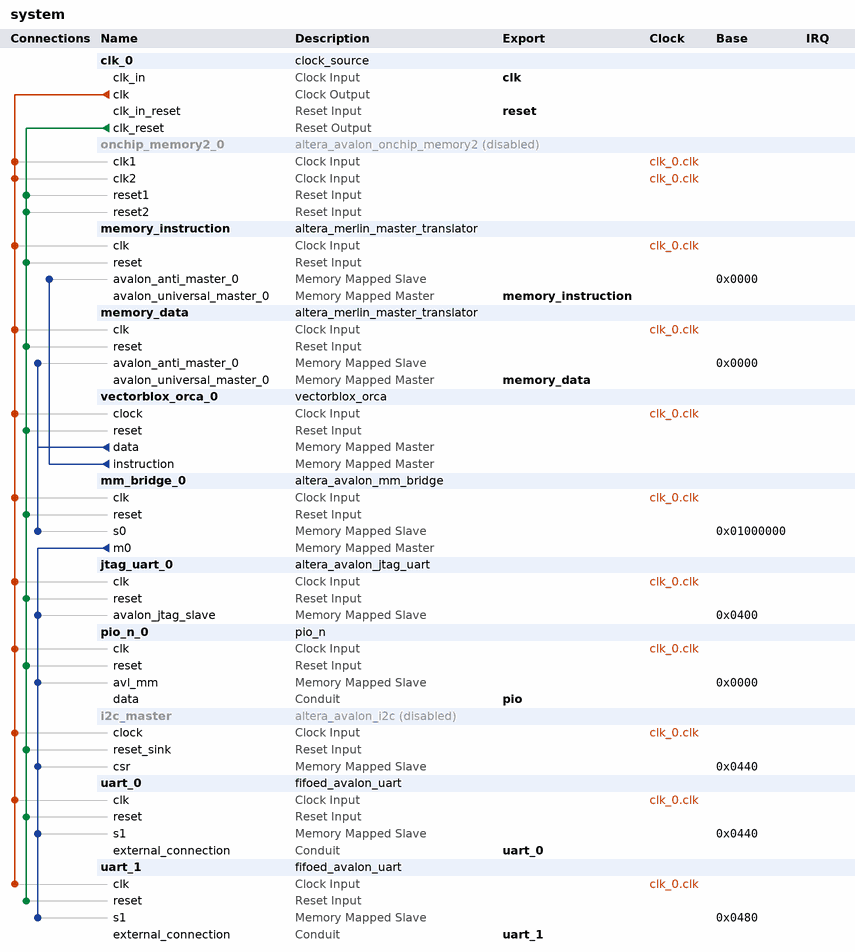
[diagram p0: system contents]
# Platform Designer (Qsys) system system, Cyclone V 5CSEBA6U23I7
# Parameters at their usual value, and those the tool derives, are not listed.
package require -exact qsys 16.1
create_system system
set_project_property DEVICE_FAMILY {Cyclone V}
set_project_property DEVICE 5CSEBA6U23I7

add_instance clk_0 clock_source 16.1
set_instance_parameter_value clk_0 clockFrequency 50000000

add_instance onchip_memory2_0 altera_avalon_onchip_memory2 16.1
set_instance_property onchip_memory2_0 ENABLED false
set_instance_parameter_value onchip_memory2_0 dataWidth 32
set_instance_parameter_value onchip_memory2_0 dualPort true
set_instance_parameter_value onchip_memory2_0 initMemContent true
set_instance_parameter_value onchip_memory2_0 initializationFileName system.hex
set_instance_parameter_value onchip_memory2_0 memorySize 65536
set_instance_parameter_value onchip_memory2_0 useNonDefaultInitFile true

add_instance memory_instruction altera_merlin_master_translator 16.1
set_instance_parameter_value memory_instruction AV_ADDRESSGROUP 0
set_instance_parameter_value memory_instruction AV_ADDRESS_SYMBOLS 0
set_instance_parameter_value memory_instruction AV_ADDRESS_W 22
set_instance_parameter_value memory_instruction AV_ALWAYSBURSTMAXBURST 0
set_instance_parameter_value memory_instruction AV_BITS_PER_SYMBOL 8
set_instance_parameter_value memory_instruction AV_BURSTBOUNDARIES 0
set_instance_parameter_value memory_instruction AV_BURSTCOUNT_SYMBOLS 0
set_instance_parameter_value memory_instruction AV_BURSTCOUNT_W 1
set_instance_parameter_value memory_instruction AV_BYTEENABLE_W 4
set_instance_parameter_value memory_instruction AV_CONSTANT_BURST_BEHAVIOR 0
set_instance_parameter_value memory_instruction AV_DATA_HOLD 0
set_instance_parameter_value memory_instruction AV_DATA_W 32
set_instance_parameter_value memory_instruction AV_INTERLEAVEBURSTS 0
set_instance_parameter_value memory_instruction AV_ISBIGENDIAN 0
set_instance_parameter_value memory_instruction AV_LINEWRAPBURSTS 0
set_instance_parameter_value memory_instruction AV_MAX_PENDING_READ_TRANSACTIONS 64
set_instance_parameter_value memory_instruction AV_READLATENCY 0
set_instance_parameter_value memory_instruction AV_READ_WAIT 0
set_instance_parameter_value memory_instruction AV_REGISTERINCOMINGSIGNALS 0
set_instance_parameter_value memory_instruction AV_REGISTEROUTGOINGSIGNALS 0
set_instance_parameter_value memory_instruction AV_SETUP_WAIT 0
set_instance_parameter_value memory_instruction AV_SYMBOLS_PER_WORD 4
set_instance_parameter_value memory_instruction AV_WRITE_WAIT 0
set_instance_parameter_value memory_instruction SYNC_RESET 0
set_instance_parameter_value memory_instruction UAV_ADDRESSGROUP 0
set_instance_parameter_value memory_instruction UAV_ADDRESS_W 24
set_instance_parameter_value memory_instruction UAV_BURSTCOUNT_W 1
set_instance_parameter_value memory_instruction UAV_CONSTANT_BURST_BEHAVIOR 0
set_instance_parameter_value memory_instruction USE_ADDRESS 1
set_instance_parameter_value memory_instruction USE_BEGINBURSTTRANSFER 0
set_instance_parameter_value memory_instruction USE_BEGINTRANSFER 0
set_instance_parameter_value memory_instruction USE_BURSTCOUNT 0
set_instance_parameter_value memory_instruction USE_BYTEENABLE 1
set_instance_parameter_value memory_instruction USE_CHIPSELECT 1
set_instance_parameter_value memory_instruction USE_CLKEN 1
set_instance_parameter_value memory_instruction USE_DEBUGACCESS 0
set_instance_parameter_value memory_instruction USE_LOCK 0
set_instance_parameter_value memory_instruction USE_READ 1
set_instance_parameter_value memory_instruction USE_READDATA 1
set_instance_parameter_value memory_instruction USE_READDATAVALID 1
set_instance_parameter_value memory_instruction USE_READRESPONSE 0
set_instance_parameter_value memory_instruction USE_WAITREQUEST 0
set_instance_parameter_value memory_instruction USE_WRITE 1
set_instance_parameter_value memory_instruction USE_WRITEDATA 1
set_instance_parameter_value memory_instruction USE_WRITERESPONSE 0

add_instance memory_data altera_merlin_master_translator 16.1
set_instance_parameter_value memory_data AV_ADDRESSGROUP 0
set_instance_parameter_value memory_data AV_ADDRESS_SYMBOLS 0
set_instance_parameter_value memory_data AV_ADDRESS_W 22
set_instance_parameter_value memory_data AV_ALWAYSBURSTMAXBURST 0
set_instance_parameter_value memory_data AV_BITS_PER_SYMBOL 8
set_instance_parameter_value memory_data AV_BURSTBOUNDARIES 0
set_instance_parameter_value memory_data AV_BURSTCOUNT_SYMBOLS 0
set_instance_parameter_value memory_data AV_BURSTCOUNT_W 1
set_instance_parameter_value memory_data AV_BYTEENABLE_W 4
set_instance_parameter_value memory_data AV_CONSTANT_BURST_BEHAVIOR 0
set_instance_parameter_value memory_data AV_DATA_HOLD 0
set_instance_parameter_value memory_data AV_DATA_W 32
set_instance_parameter_value memory_data AV_INTERLEAVEBURSTS 0
set_instance_parameter_value memory_data AV_ISBIGENDIAN 0
set_instance_parameter_value memory_data AV_LINEWRAPBURSTS 0
set_instance_parameter_value memory_data AV_MAX_PENDING_READ_TRANSACTIONS 64
set_instance_parameter_value memory_data AV_READLATENCY 0
set_instance_parameter_value memory_data AV_READ_WAIT 0
set_instance_parameter_value memory_data AV_REGISTERINCOMINGSIGNALS 0
set_instance_parameter_value memory_data AV_REGISTEROUTGOINGSIGNALS 0
set_instance_parameter_value memory_data AV_SETUP_WAIT 0
set_instance_parameter_value memory_data AV_SYMBOLS_PER_WORD 4
set_instance_parameter_value memory_data AV_WRITE_WAIT 0
set_instance_parameter_value memory_data SYNC_RESET 0
set_instance_parameter_value memory_data UAV_ADDRESSGROUP 0
set_instance_parameter_value memory_data UAV_ADDRESS_W 24
set_instance_parameter_value memory_data UAV_BURSTCOUNT_W 1
set_instance_parameter_value memory_data UAV_CONSTANT_BURST_BEHAVIOR 0
set_instance_parameter_value memory_data USE_ADDRESS 1
set_instance_parameter_value memory_data USE_BEGINBURSTTRANSFER 0
set_instance_parameter_value memory_data USE_BEGINTRANSFER 0
set_instance_parameter_value memory_data USE_BURSTCOUNT 0
set_instance_parameter_value memory_data USE_BYTEENABLE 1
set_instance_parameter_value memory_data USE_CHIPSELECT 1
set_instance_parameter_value memory_data USE_CLKEN 1
set_instance_parameter_value memory_data USE_DEBUGACCESS 0
set_instance_parameter_value memory_data USE_LOCK 0
set_instance_parameter_value memory_data USE_READ 1
set_instance_parameter_value memory_data USE_READDATA 1
set_instance_parameter_value memory_data USE_READDATAVALID 1
set_instance_parameter_value memory_data USE_READRESPONSE 0
set_instance_parameter_value memory_data USE_WAITREQUEST 0
set_instance_parameter_value memory_data USE_WRITE 1
set_instance_parameter_value memory_data USE_WRITEDATA 1
set_instance_parameter_value memory_data USE_WRITERESPONSE 0

add_instance vectorblox_orca_0 vectorblox_orca 1.0
set_instance_parameter_value vectorblox_orca_0 BRANCH_PREDICTION false
set_instance_parameter_value vectorblox_orca_0 BTB_SIZE 0
set_instance_parameter_value vectorblox_orca_0 BUS_TYPE Avalon
set_instance_parameter_value vectorblox_orca_0 COUNTER_LENGTH 64
set_instance_parameter_value vectorblox_orca_0 DIVIDE_ENABLE 1
set_instance_parameter_value vectorblox_orca_0 ENABLE_EXCEPTIONS 1
set_instance_parameter_value vectorblox_orca_0 EXT_INTERRUPTS 0
set_instance_parameter_value vectorblox_orca_0 LVE_ENABLE 0
set_instance_parameter_value vectorblox_orca_0 MULTIPLY_ENABLE 1
set_instance_parameter_value vectorblox_orca_0 PIPELINE_STAGES 4
set_instance_parameter_value vectorblox_orca_0 REGISTER_SIZE 32
set_instance_parameter_value vectorblox_orca_0 RESET_VECTOR 512
set_instance_parameter_value vectorblox_orca_0 SCRATCHPAD_SIZE 1024
set_instance_parameter_value vectorblox_orca_0 SHIFTER_MAX_CYCLES 1

add_instance mm_bridge_0 altera_avalon_mm_bridge 16.1
set_instance_parameter_value mm_bridge_0 ADDRESS_UNITS SYMBOLS
set_instance_parameter_value mm_bridge_0 ADDRESS_WIDTH 11
set_instance_parameter_value mm_bridge_0 DATA_WIDTH 32
set_instance_parameter_value mm_bridge_0 MAX_PENDING_RESPONSES 1
set_instance_parameter_value mm_bridge_0 PIPELINE_COMMAND 0
set_instance_parameter_value mm_bridge_0 PIPELINE_RESPONSE 0
set_instance_parameter_value mm_bridge_0 USE_AUTO_ADDRESS_WIDTH 1

add_instance jtag_uart_0 altera_avalon_jtag_uart 16.1
set_instance_parameter_value jtag_uart_0 readBufferDepth 8
set_instance_parameter_value jtag_uart_0 simInteractiveOptions NO_INTERACTIVE_WINDOWS

add_instance pio_n_0 pio_n 1.0
set_instance_parameter_value pio_n_0 ByteEnable false
set_instance_parameter_value pio_n_0 RegCnt 16

add_instance i2c_master altera_avalon_i2c 16.1
set_instance_property i2c_master ENABLED false
set_instance_parameter_value i2c_master FIFO_DEPTH 4

add_instance uart_0 fifoed_avalon_uart 13.2
set_instance_parameter_value uart_0 add_error_bits false
set_instance_parameter_value uart_0 baud 115200
set_instance_parameter_value uart_0 dataBits 8
set_instance_parameter_value uart_0 driver_pass_error_bits false
set_instance_parameter_value uart_0 export_handshake false
set_instance_parameter_value uart_0 fifo_export_used false
set_instance_parameter_value uart_0 fifo_size_rx 32
set_instance_parameter_value uart_0 fifo_size_tx 32
set_instance_parameter_value uart_0 fixedBaud false
set_instance_parameter_value uart_0 gap_value 4
set_instance_parameter_value uart_0 hw_cts false
set_instance_parameter_value uart_0 parity NONE
set_instance_parameter_value uart_0 rx_IRQ_Threshold 1
set_instance_parameter_value uart_0 rx_fifo_LE false
set_instance_parameter_value uart_0 simInteractiveInputEnable false
set_instance_parameter_value uart_0 simInteractiveOutputEnable false
set_instance_parameter_value uart_0 simTrueBaud false
set_instance_parameter_value uart_0 stopBits 1
set_instance_parameter_value uart_0 syncRegDepth 2
set_instance_parameter_value uart_0 timeout_value 4
set_instance_parameter_value uart_0 timestamp_width 8
set_instance_parameter_value uart_0 trans_pin false
set_instance_parameter_value uart_0 tx_IRQ_Threshold 1
set_instance_parameter_value uart_0 tx_fifo_LE false
set_instance_parameter_value uart_0 useCtsRts false
set_instance_parameter_value uart_0 useEopRegister false
set_instance_parameter_value uart_0 useRelativePathForSimFile false
set_instance_parameter_value uart_0 use_ext_timestamp false
set_instance_parameter_value uart_0 use_gap_detection false
set_instance_parameter_value uart_0 use_rx_fifo true
set_instance_parameter_value uart_0 use_status_bit_clear false
set_instance_parameter_value uart_0 use_timestamp false
set_instance_parameter_value uart_0 use_timout false
set_instance_parameter_value uart_0 use_tx_fifo true

add_instance uart_1 fifoed_avalon_uart 13.2
set_instance_parameter_value uart_1 add_error_bits false
set_instance_parameter_value uart_1 baud 115200
set_instance_parameter_value uart_1 dataBits 8
set_instance_parameter_value uart_1 driver_pass_error_bits false
set_instance_parameter_value uart_1 export_handshake false
set_instance_parameter_value uart_1 fifo_export_used false
set_instance_parameter_value uart_1 fifo_size_rx 32
set_instance_parameter_value uart_1 fifo_size_tx 32
set_instance_parameter_value uart_1 fixedBaud false
set_instance_parameter_value uart_1 gap_value 4
set_instance_parameter_value uart_1 hw_cts false
set_instance_parameter_value uart_1 parity NONE
set_instance_parameter_value uart_1 rx_IRQ_Threshold 1
set_instance_parameter_value uart_1 rx_fifo_LE false
set_instance_parameter_value uart_1 simInteractiveInputEnable false
set_instance_parameter_value uart_1 simInteractiveOutputEnable false
set_instance_parameter_value uart_1 simTrueBaud false
set_instance_parameter_value uart_1 stopBits 1
set_instance_parameter_value uart_1 syncRegDepth 2
set_instance_parameter_value uart_1 timeout_value 4
set_instance_parameter_value uart_1 timestamp_width 8
set_instance_parameter_value uart_1 trans_pin false
set_instance_parameter_value uart_1 tx_IRQ_Threshold 1
set_instance_parameter_value uart_1 tx_fifo_LE false
set_instance_parameter_value uart_1 useCtsRts false
set_instance_parameter_value uart_1 useEopRegister false
set_instance_parameter_value uart_1 useRelativePathForSimFile false
set_instance_parameter_value uart_1 use_ext_timestamp false
set_instance_parameter_value uart_1 use_gap_detection false
set_instance_parameter_value uart_1 use_rx_fifo true
set_instance_parameter_value uart_1 use_status_bit_clear false
set_instance_parameter_value uart_1 use_timestamp false
set_instance_parameter_value uart_1 use_timout false
set_instance_parameter_value uart_1 use_tx_fifo true

# connections
add_connection clk_0.clk i2c_master.clock clock
add_connection clk_0.clk jtag_uart_0.clk clock
add_connection clk_0.clk memory_data.clk clock
add_connection clk_0.clk memory_instruction.clk clock
add_connection clk_0.clk mm_bridge_0.clk clock
add_connection clk_0.clk onchip_memory2_0.clk1 clock
add_connection clk_0.clk onchip_memory2_0.clk2 clock
add_connection clk_0.clk pio_n_0.clk clock
add_connection clk_0.clk uart_0.clk clock
add_connection clk_0.clk uart_1.clk clock
add_connection clk_0.clk vectorblox_orca_0.clock clock
add_connection clk_0.clk_reset i2c_master.reset_sink reset
add_connection clk_0.clk_reset jtag_uart_0.reset reset
add_connection clk_0.clk_reset memory_data.reset reset
add_connection clk_0.clk_reset memory_instruction.reset reset
add_connection clk_0.clk_reset mm_bridge_0.reset reset
add_connection clk_0.clk_reset onchip_memory2_0.reset1 reset
add_connection clk_0.clk_reset onchip_memory2_0.reset2 reset
add_connection clk_0.clk_reset pio_n_0.reset reset
add_connection clk_0.clk_reset uart_0.reset reset
add_connection clk_0.clk_reset uart_1.reset reset
add_connection clk_0.clk_reset vectorblox_orca_0.reset reset
add_connection mm_bridge_0.m0 i2c_master.csr avalon
set_connection_parameter_value mm_bridge_0.m0/i2c_master.csr baseAddress 0x0440
add_connection mm_bridge_0.m0 jtag_uart_0.avalon_jtag_slave avalon
set_connection_parameter_value mm_bridge_0.m0/jtag_uart_0.avalon_jtag_slave baseAddress 0x0400
add_connection mm_bridge_0.m0 pio_n_0.avl_mm avalon
set_connection_parameter_value mm_bridge_0.m0/pio_n_0.avl_mm baseAddress 0x0000
add_connection mm_bridge_0.m0 uart_0.s1 avalon
set_connection_parameter_value mm_bridge_0.m0/uart_0.s1 baseAddress 0x0440
add_connection mm_bridge_0.m0 uart_1.s1 avalon
set_connection_parameter_value mm_bridge_0.m0/uart_1.s1 baseAddress 0x0480
add_connection vectorblox_orca_0.data memory_data.avalon_anti_master_0 avalon
set_connection_parameter_value vectorblox_orca_0.data/memory_data.avalon_anti_master_0 baseAddress 0x0000
add_connection vectorblox_orca_0.data mm_bridge_0.s0 avalon
set_connection_parameter_value vectorblox_orca_0.data/mm_bridge_0.s0 baseAddress 0x01000000
add_connection vectorblox_orca_0.instruction memory_instruction.avalon_anti_master_0 avalon
set_connection_parameter_value vectorblox_orca_0.instruction/memory_instruction.avalon_anti_master_0 baseAddress 0x0000

# exported interfaces
add_interface clk clock sink
set_interface_property clk EXPORT_OF clk_0.clk_in
add_interface memory_data avalon master
set_interface_property memory_data EXPORT_OF memory_data.avalon_universal_master_0
add_interface memory_instruction avalon master
set_interface_property memory_instruction EXPORT_OF memory_instruction.avalon_universal_master_0
add_interface pio conduit end
set_interface_property pio EXPORT_OF pio_n_0.data
add_interface reset reset sink
set_interface_property reset EXPORT_OF clk_0.clk_in_reset
add_interface uart_0 conduit end
set_interface_property uart_0 EXPORT_OF uart_0.external_connection
add_interface uart_1 conduit end
set_interface_property uart_1 EXPORT_OF uart_1.external_connection

set_interconnect_requirement {$system} qsys_mm.clockCrossingAdapter HANDSHAKE
set_interconnect_requirement {$system} qsys_mm.insertDefaultSlave FALSE
set_interconnect_requirement {$system} qsys_mm.maxAdditionalLatency 1

save_system system.qsys
